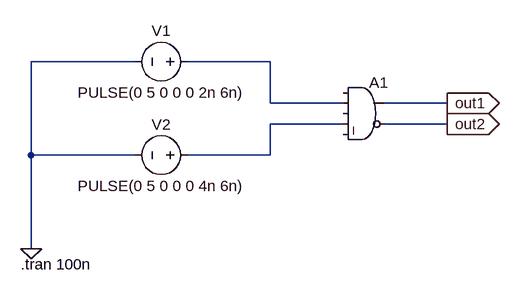
[diagram p0: schematic and.asc]
and.asc, the LTspice schematic file:
Version 4.1
SHEET 1 880 680
WIRE -192 16 -352 16
WIRE 16 16 -112 16
WIRE 16 80 16 16
WIRE 128 80 16 80
WIRE 288 80 192 80
WIRE 128 112 16 112
WIRE 288 112 192 112
WIRE -352 160 -352 16
WIRE -192 160 -352 160
WIRE 16 160 16 112
WIRE 16 160 -112 160
WIRE -352 304 -352 160
FLAG -352 304 0
FLAG 288 80 out1
IOPIN 288 80 Out
FLAG 288 112 out2
IOPIN 288 112 Out
SYMBOL Digital\\and 160 32 R0
SYMATTR InstName A1
SYMBOL voltage -96 16 R90
WINDOW 0 -32 56 VBottom 2
WINDOW 3 32 56 VTop 2
WINDOW 123 0 0 Left 0
WINDOW 39 0 0 Left 0
SYMATTR InstName V1
SYMATTR Value PULSE(0 5 0 0 0 2n 6n)
SYMBOL voltage -96 160 R90
WINDOW 0 -32 56 VBottom 2
WINDOW 3 32 56 VTop 2
WINDOW 123 0 0 Left 0
WINDOW 39 0 0 Left 0
SYMATTR InstName V2
SYMATTR Value PULSE(0 5 0 0 0 4n 6n)
TEXT -368 328 Left 2 !.tran 100n

The netlist it stands for:
* and.asc
A1 0 N001 0 N002 0 out2 out1 0 AND
V1 N001 0 PULSE(0 5 0 0 0 2n 6n)
V2 N002 0 PULSE(0 5 0 0 0 4n 6n)
.tran 100n
.backanno
.end

* Results of the author's LTspice run, read from the files saved beside the schematic
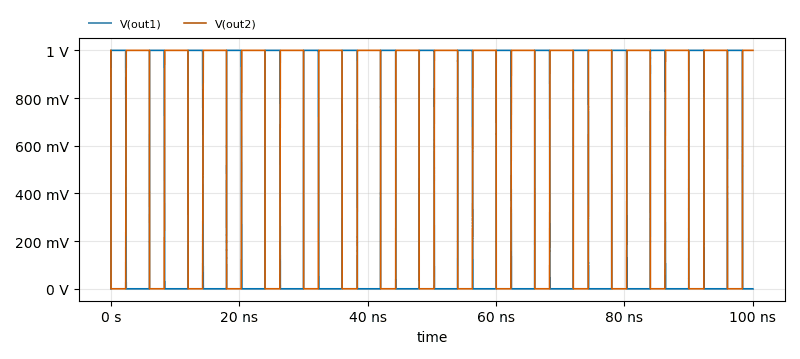
[diagram p1: Transient Analysis of and.asc, plotted from the saved traces]
* Transient Analysis, 1 run:
*   V(out1): min 0 V, max 1 V, average 398.4 mV, rms 631.2 mV, last 0 V
*   V(out2): min 0 V, max 1 V, average 601.6 mV, rms 775.7 mV, last 1 V